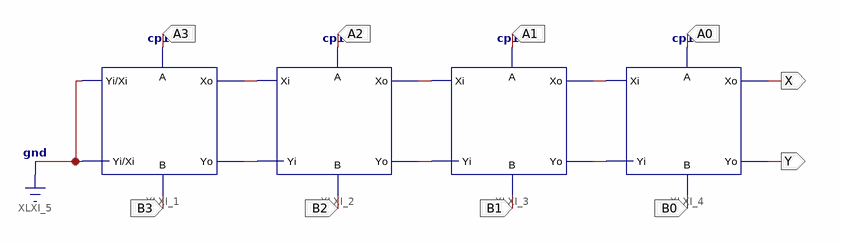
[diagram p0: schematic sheet 1]
// Xilinx ISE schematic cp4b.sch (xc9500) as structural Verilog: 4 symbols, 10 ports
module cp4b (
  input  A3,
  input  B3,
  input  A2,
  input  B2,
  input  A1,
  input  B1,
  input  B0,
  input  A0,
  output X,
  output Y
);

  wire XLXN_1, XLXN_2, XLXN_3, XLXN_4, XLXN_5, XLXN_6;

  cp1b XLXI_1 (.Yi(1'b0), .Xo(XLXN_2), .Yo(XLXN_1), .A(A3), .Xi(1'b0), .B(B3));
  cp1b XLXI_2 (.Yi(XLXN_1), .Xo(XLXN_4), .Yo(XLXN_3), .A(A2), .Xi(XLXN_2), .B(B2));
  cp1b XLXI_3 (.Yi(XLXN_3), .Xo(XLXN_6), .Yo(XLXN_5), .A(A1), .Xi(XLXN_4), .B(B1));
  cp1b XLXI_4 (.Yi(XLXN_5), .Xo(X), .Yo(Y), .A(A0), .Xi(XLXN_6), .B(B0));
endmodule
